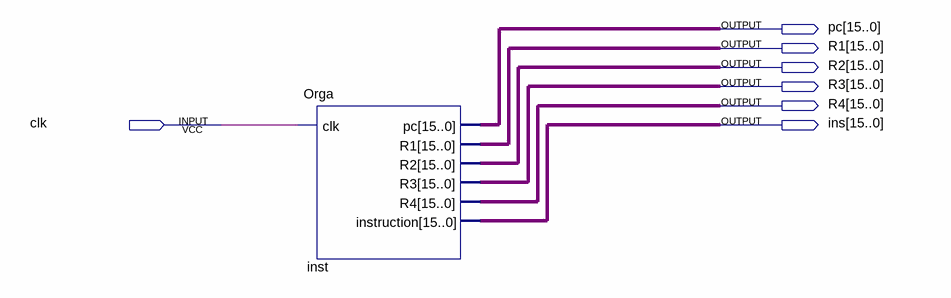
[diagram p0: schematic sheet]
// Quartus schematic SimpleComputerBlock.bdf as structural Verilog: 1 symbols, 7 pins
module SimpleComputerBlock (
  input  clk,
  output [15:0] pc,
  output [15:0] R1,
  output [15:0] R2,
  output [15:0] R3,
  output [15:0] R4,
  output [15:0] ins
);

  Orga inst (.clk(clk), .pc(pc), .R1(R1), .R2(R2), .R3(R3), .R4(R4), .instruction(ins));
endmodule
